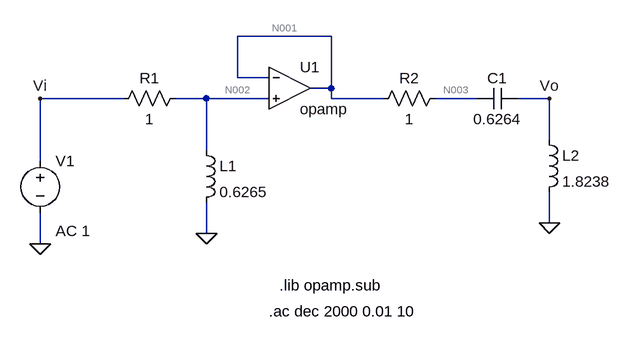
[diagram p0: schematic solo_inductores.asc]
solo_inductores.asc, the LTspice schematic file:
Version 4.1
SHEET 1 880 680
WIRE 352 64 208 64
WIRE 208 128 208 64
WIRE 256 128 208 128
WIRE 352 144 352 64
WIRE 352 144 320 144
WIRE 32 160 -96 160
WIRE 160 160 112 160
WIRE 256 160 160 160
WIRE 352 160 352 144
WIRE 432 160 352 160
WIRE 576 160 512 160
WIRE 688 160 640 160
WIRE 688 224 688 160
WIRE 160 240 160 160
WIRE -96 256 -96 160
WIRE 688 352 688 304
WIRE 160 368 160 320
WIRE -96 384 -96 336
FLAG -96 384 0
FLAG 160 368 0
FLAG 688 352 0
FLAG 688 160 Vo
FLAG -96 160 Vi
SYMBOL res 128 144 R90
WINDOW 0 0 56 VBottom 2
WINDOW 3 32 56 VTop 2
SYMATTR InstName R1
SYMATTR Value 1
SYMBOL res 528 144 R90
WINDOW 0 0 56 VBottom 2
WINDOW 3 32 56 VTop 2
SYMATTR InstName R2
SYMATTR Value 1
SYMBOL cap 640 144 R90
WINDOW 0 0 32 VBottom 2
WINDOW 3 32 32 VTop 2
SYMATTR InstName C1
SYMATTR Value 0.6264
SYMBOL ind 144 224 R0
SYMATTR InstName L1
SYMATTR Value 0.6265
SYMBOL ind 672 208 R0
SYMATTR InstName L2
SYMATTR Value 1.8238
SYMBOL OpAmps\\opamp 288 80 R0
SYMATTR InstName U1
SYMBOL voltage -96 240 R0
WINDOW 123 24 124 Left 2
WINDOW 39 0 0 Left 0
SYMATTR InstName V1
SYMATTR Value ""
SYMATTR Value2 AC 1
TEXT 272 448 Left 2 !.lib opamp.sub
TEXT 256 488 Left 2 !.ac dec 2000 0.01 10

The netlist it stands for:
* solo_inductores.asc
R1 N002 Vi 1
R2 N003 N001 1
C1 Vo N003 0.6264
L1 N002 0 0.6265
L2 Vo 0 1.8238
X§U1 N001 N002 N001 opamp Aol=100K GBW=10Meg  ; pins invin noninvin out
V1 Vi 0 AC 1
.lib opamp.sub
.ac dec 2000 0.01 10
.backanno
.end

* Results of the author's LTspice run, read from the files saved beside the schematic
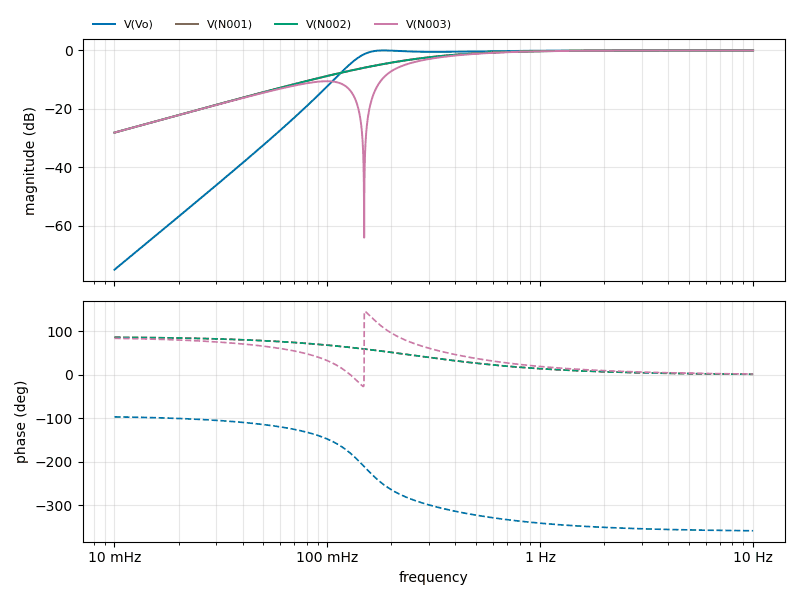
[diagram p1: AC Analysis of solo_inductores.asc, plotted from the saved traces]
* AC Analysis, 1 run:
*   V(Vo): -74.99 dB at 10 mHz, -0.00 dB at 10 Hz, peak -0.00 dB at 10 Hz, 3 dB below the peak at 136.4 mHz
*   V(N001): -28.11 dB at 10 mHz, -0.00 dB at 10 Hz, peak -0.00 dB at 10 Hz, 3 dB below the peak at 254.1 mHz
*   V(N002): -28.11 dB at 10 mHz, -0.00 dB at 10 Hz, peak -0.00 dB at 10 Hz, 3 dB below the peak at 254.1 mHz
*   V(N003): -28.12 dB at 10 mHz, -0.00 dB at 10 Hz, peak -0.00 dB at 10 Hz, 3 dB below the peak at 296.9 mHz